# Altium schematic sheet Sub_MCU.SchDoc
size A4; SheetNumber: 4; SheetTotal: 7
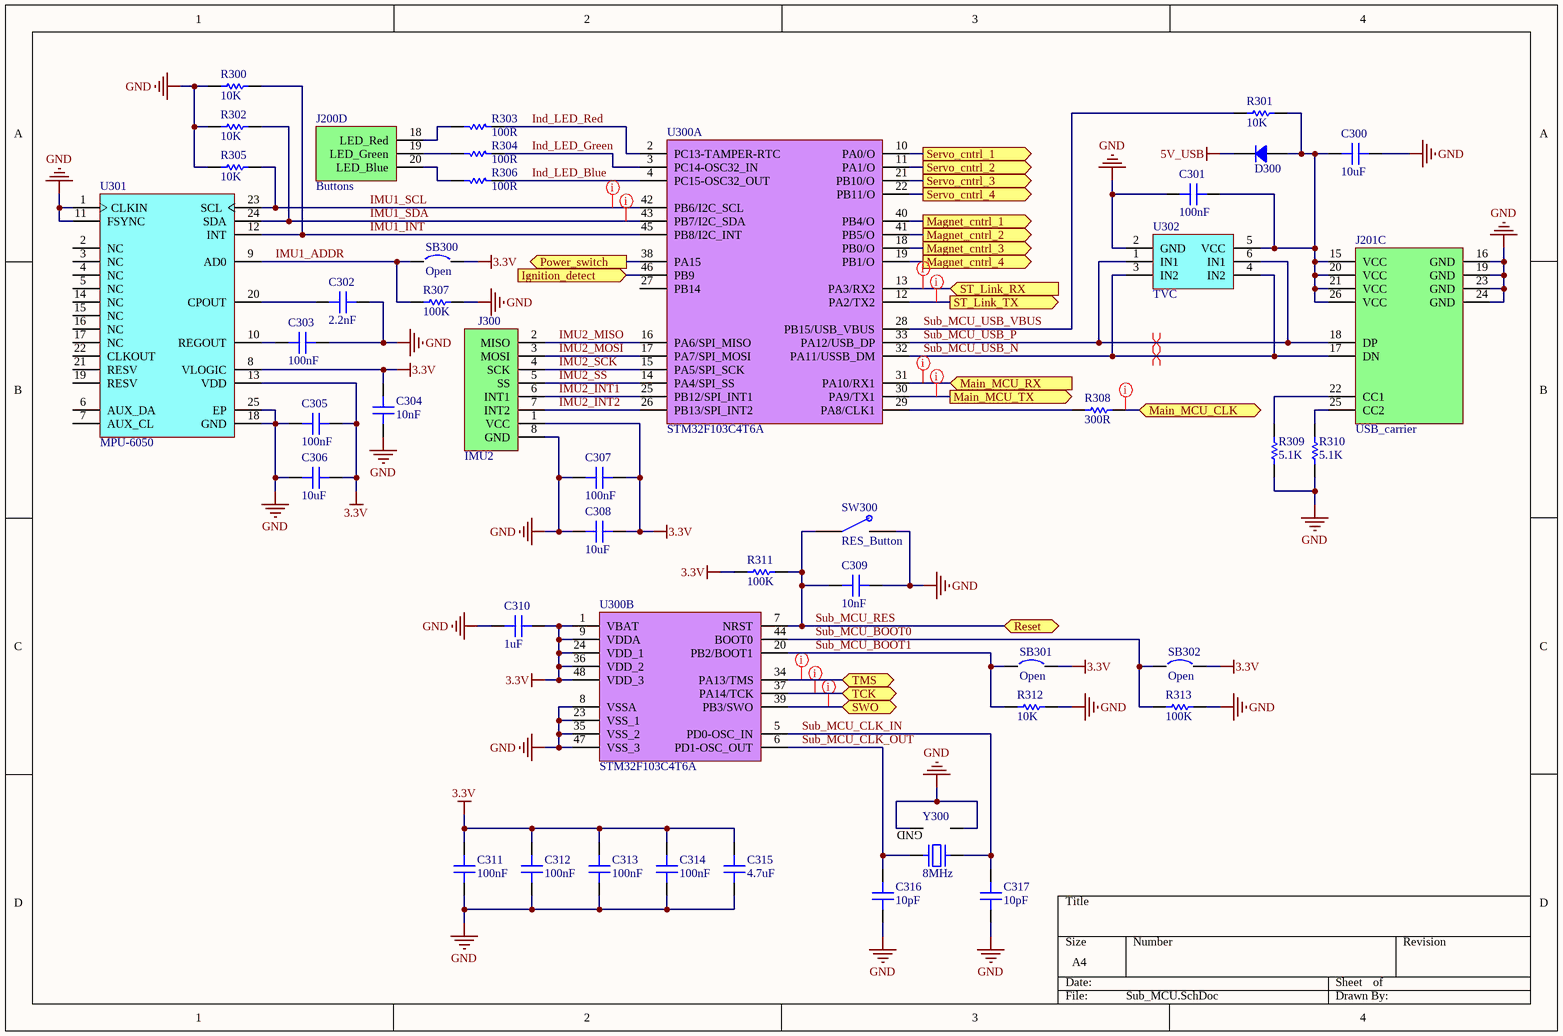
[diagram p0: Sub_MCU.SchDoc]

## Parts
C300  10uF  [CAP 0603]
C301  100nF  [CAP 0603]
C302  2.2nF  [CAP 0603]
C303  100nF  [CAP 0603]
C304  10nF  [CAP 0603]
C305  100nF  [CAP 0603]
C306  10uF  [CAP 0603]
C307  100nF  [CAP 0603]
C308  10uF  [CAP 0603]
C309  10nF  [CAP 0603]
C310  1uF  [CAP 0603]
C311  100nF  [CAP 0603]
C312  100nF  [CAP 0603]
C313  100nF  [CAP 0603]
C314  100nF  [CAP 0603]
C315  4.7uF  [CAP 1206]
C316  10pF  [CAP 0603]
C317  10pF  [CAP 0603]
D300  (no value)  [Bourns DO214AC SMA - duplicate]
J200  Buttons  [2167010409]  (part D of 6)
J201  USB_carrier  [2167010409]  (part C of 4)
J300  IMU2  [SAMTEC_DWM-08-X-X-S-X]
R300  10K  [RES 0603]
R301  10K  [RES 0603]
R302  10K  [RES 0603]
R303  100R  [RES 0603]
R304  100R  [RES 0603]
R305  10K  [RES 0603]
R306  100R  [RES 0603]
R307  100K  [RES 0603]
R308  300R  [RES 0603]
R309  5.1K  [RES 0603]
R310  5.1K  [RES 0603]
R311  100K  [RES 0603]
R312  10K  [RES 0603]
R313  100K  [RES 0603]
SB300  Open  [SB_0603]
SB301  Open  [SB_0603]
SB302  Open  [SB_0603]
SW300  RES_Button  [PTS636SM50JSMTRLFS]
U300  STM32F103C4T6A  [TI PQFP-48 PAG0048A]  (parts A,B of 2)
U301  MPU-6050  [IS-QFN-24_V]
U302  TVC  [DIODES SOT-23-6 W6]
Y300  8MHz  [XTAL_ECS-80-10-33-CHN-TR3]

## Ports
Ignition_detect (in, see Main_scheme[3A], Power[3A]), Magnet_cntrl_1 (out, see Main_scheme[3A]), Magnet_cntrl_2 (out, see Main_scheme[3B]), Magnet_cntrl_3 (out, see Main_scheme[3C]), Magnet_cntrl_4 (out, see Main_scheme[3C]), Main_MCU_CLK (bidir, see Main_scheme[3A]), Main_MCU_RX (in, see Main_scheme[3A]), Main_MCU_TX (out, see Main_scheme[3A]), Power_switch (out, see Main_scheme[3A], Power[4C]), Reset (bidir, see Main_scheme[3D]), Servo_cntrl_1 (out, see Main_scheme[3A]), Servo_cntrl_2 (out, see Main_scheme[3B]), Servo_cntrl_3 (out, see Main_scheme[3B]), Servo_cntrl_4 (out, see Main_scheme[3C]), ST_Link_RX (in, see Main_scheme[3D]), ST_Link_TX (out, see Main_scheme[3D]), SWO (bidir, see Main_scheme[3D]), TCK (bidir, see Main_scheme[3C]), TMS (bidir, see Main_scheme[3D])

## Nets
3.3V: C304.1 C305.2 C306.2 C307.2 C308.2 C310.2 C311.2 C312.2 C313.2 C314.2 C315.2 J300.1(VCC) R311.2 SB300.2 SB301.2 SB302.2 U300.1(VBAT) U300.9(VDDA) U300.24(VDD_1) U300.36(VDD_2) U300.48(VDD_3) U301.8(VLOGIC) U301.13(VDD)
5V_USB: D300.2
GND: C300.2 C301.1 C302.2 C303.2 C304.2 C305.1 C306.1 C307.1 C308.1 C309.1 C310.1 C311.1 C312.1 C313.1 C314.1 C315.1 C316.1 C317.1 J201.16(GND) J201.19(GND) J201.23(GND) J201.24(GND) J300.8(GND) R300.2 R302.2 R305.2 R307.1 R309.1 R310.1 R312.1 R313.1 SW300.2 U300.8(VSSA) U300.23(VSS_1) U300.35(VSS_2) U300.47(VSS_3) U301.1(CLKIN) U301.11(FSYNC) U301.18(GND) U301.25(EP) U302.2(GND) Y300.2(GND) Y300.4(GND)
Ignition_detect: U300.46(PB9) ; port Ignition_detect
IMU1_ADDR: R307.2 SB300.1 U301.9(AD0)
IMU1_INT: R300.1 U300.45(PB8/I2C_INT) U301.12(INT)
IMU1_SCL: R305.1 U300.42(PB6/I2C_SCL) U301.23(SCL)
IMU1_SDA: R302.1 U300.43(PB7/I2C_SDA) U301.24(SDA)
IMU2_INT1: J300.6(INT1) U300.25(PB12/SPI_INT1)
IMU2_INT2: J300.7(INT2) U300.26(PB13/SPI_INT2)
IMU2_MISO: J300.2(MISO) U300.16(PA6/SPI_MISO)
IMU2_MOSI: J300.3(MOSI) U300.17(PA7/SPI_MOSI)
IMU2_SCK: J300.4(SCK) U300.15(PA5/SPI_SCK)
IMU2_SS: J300.5(SS) U300.14(PA4/SPI_SS)
Ind_LED_Blue: R306.2 U300.4(PC15-OSC32_OUT)
Ind_LED_Green: R304.2 U300.3(PC14-OSC32_IN)
Ind_LED_Red: R303.2 U300.2(PC13-TAMPER-RTC)
Magnet_cntrl_1: U300.40(PB4/O) ; port Magnet_cntrl_1
Magnet_cntrl_2: U300.41(PB5/O) ; port Magnet_cntrl_2
Magnet_cntrl_3: U300.18(PB0/O) ; port Magnet_cntrl_3
Magnet_cntrl_4: U300.19(PB1/O) ; port Magnet_cntrl_4
Main_MCU_CLK: R308.1 ; port Main_MCU_CLK
Main_MCU_RX: U300.31(PA10/RX1) ; port Main_MCU_RX
Main_MCU_TX: U300.30(PA9/TX1) ; port Main_MCU_TX
Power_switch: U300.38(PA15) ; port Power_switch
Servo_cntrl_1: U300.10(PA0/O) ; port Servo_cntrl_1
Servo_cntrl_2: U300.11(PA1/O) ; port Servo_cntrl_2
Servo_cntrl_3: U300.21(PB10/O) ; port Servo_cntrl_3
Servo_cntrl_4: U300.22(PB11/O) ; port Servo_cntrl_4
ST_Link_RX: U300.13(PA3/RX2) ; port ST_Link_RX
ST_Link_TX: U300.12(PA2/TX2) ; port ST_Link_TX
Sub_MCU_BOOT0: R313.2 SB302.1 U300.44(BOOT0)
Sub_MCU_BOOT1: R312.2 SB301.1 U300.20(PB2/BOOT1)
Sub_MCU_CLK_IN: C317.2 U300.5(PD0-OSC_IN) Y300.3
Sub_MCU_CLK_OUT: C316.2 U300.6(PD1-OSC_OUT) Y300.1
Sub_MCU_RES: C309.2 R311.1 SW300.1 U300.7(NRST) ; port Reset
Sub_MCU_USB_N: J201.17(DN) U300.32(PA11/USSB_DM) U302.3(IN2) U302.4(IN2)
Sub_MCU_USB_P: J201.18(DP) U300.33(PA12/USB_DP) U302.1(IN1) U302.6(IN1)
Sub_MCU_USB_VBUS: R301.2 U300.28(PB15/USB_VBUS)
SWO: U300.39(PB3/SWO) ; port SWO
TCK: U300.37(PA14/TCK) ; port TCK
TMS: U300.34(PA13/TMS) ; port TMS
NetC300_1: C300.1 C301.2 D300.1 J201.15(VCC) J201.20(VCC) J201.21(VCC) J201.26(VCC) R301.1 U302.5(VCC)
NetC302_1: C302.1 U301.20(CPOUT)
NetC303_1: C303.1 U301.10(REGOUT)
NetJ200_18: J200.18(LED_Red) R303.1
NetJ200_19: J200.19(LED_Green) R304.1
NetJ200_20: J200.20(LED_Blue) R306.1
NetJ201_22: J201.22(CC1) R309.2
NetJ201_25: J201.25(CC2) R310.2
NetR308_2: R308.2 U300.29(PA8/CLK1)

Not connected (* = marked no-connect by the designer): U300 27(PB14); U301 2(NC) 3(NC) 4(NC) 5(NC) 6(AUX_DA) 7(AUX_CL) 14(NC) 15(NC) 16(NC) 17(NC) 19(RESV) 21(RESV) 22(CLKOUT)

## Layout directives
differential pair: Sub_MCU_USB_N, Sub_MCU_USB_P
net class Sum_MCU_SWD: SWO, TCK, TMS
net class Main_MCU_to SUB_MCU: Main_MCU_CLK, Main_MCU_RX, Main_MCU_TX
net class ub_MCU_UART: ST_Link_RX, ST_Link_TX
net class I2C: IMU1_SCL, IMU1_SDA

## Library data of the parts
C300-C317 = Capacitor: SMT Capacitor
  C300 C306 C308: Value: 10uF
  C301 C303 C305 C307 C311-C314: Value: 100nF
  C302: Value: 2.2nF
  C304 C309: Value: 10nF
  C310: Value: 1uF
  C315: Value: 4.7uF
  C316 C317: Value: 10pF
D300 = Diode: Rectifier Diode
J200 = AUX_carrier
J300 = IMU_connector
R300-R313 = Res: Resistor; Ordered by: Subcon; Published: 8-Jun-2000; Revision: July-2002: Re-released for DXP Platform.; Publisher: Altium Limited
  R300-R302 R305 R312: Value: 10K
  R303 R304 R306: Value: 100R
  R307 R311 R313: Value: 100K
  R308: Value: 300R
  R309 R310: Value: 5.1K
SB300-SB302 = Circuit Breaker: Published: 24-Mar-1999; Revision: July-2002: Re-released for DXP Platform.; Publisher: Altium Limited
U300 = CMP-0237-00255-3: ARM Cortex-M3 32-bit MCU, 16 KB Flash, 6 KB Internal RAM, 37 I/Os, 48-pin LQFP, -40 to 85 degC, Tray; Operating Frequency(F) (Processor speed) (MHz): 72; Supply Voltage(Vcc) min (V): 2; FLASH Size (Prog) (kB): 16; A/D Converter: 2x12-bit (10 Channel); I/Os (High Current): 37; Internal RAM Size (kB): 6; ComponentLink1Description: Manufacturer URL; PartNumber: STM32F103C4T6A; ComponentLink2URL: http://www.st.com/st-web-ui/static/active/en/resource/technical/document/datasheet/CD00210843.pdf; PackageVersion: Rev. 6, 06/2013; ComponentLink2Description: Datasheet; Core: ARM Cortex-M3; ComponentLink3URL: http://www.st.com/st-web-ui/static/active/en/resource/technical/document/datasheet/DM00058181.pdf; PackageDescription: 48-Pin Low Profile Quad Flat Package, 7 x 7 mm Body, 0.5 mm Pitch; ComponentLink1URL: http://www.st.com/web/en/home.html; Packing: Tray; Mounting Technology: Surface Mount; PackageReference: LQFP48; ComponentLink3Description: Package Specification; DatasheetVersion: Rev. 6
U301 = CMP-1753-00002-2: 3-Axis Gyroscope, Accelerometer and a Digital Motion Processor(TM) (DMP), 2.375 to 3.46 V, -40 to 85 degC, 24-Pin QFN, RoHS, Tape and Reel; Manufacturer: InvenSense; Featured Product: MPU-60506-Axis,IntegratedI²CSolution; Other Names: 1428-1007-2 / MPU6050; Sensor Type: MotionTracking; Online Catalog: MPU-6000™Series; Unit PriceUSD: Digital; Datasheet Version: Rev. 3.3, 05/2012; Category: Sensors,Transducers; Datasheet URL: http://datasheet.octopart.com/MPU-6050-InvenSense-datasheet-14421344.pdf; Family: Multifunction; Standard Package: 5,000; Manufacturer URL: http://www.invensense.com/; Output Type: Digital; Dynamic Catalog: MPU-6000™Series
U302 = USB_TVC_protection
Y300 = Crystal 8Mhz: SMT Crystal; Value: 8MHz